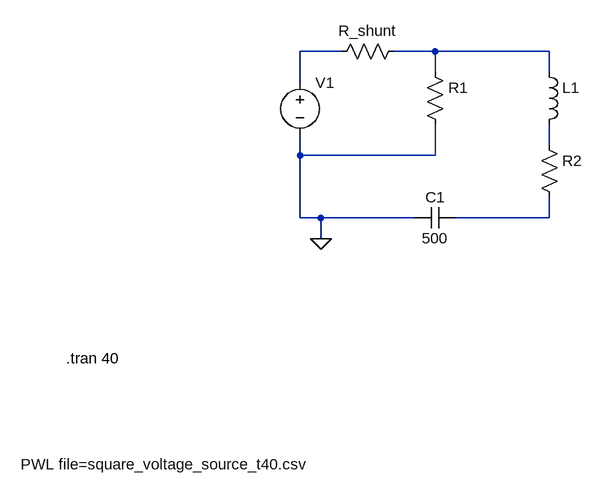
[diagram p0: schematic rlc_proposal.asc]
rlc_proposal.asc, the LTspice schematic file:
Version 4.1
SHEET 1 880 748
WIRE 112 96 48 96
WIRE 256 96 192 96
WIRE 432 96 256 96
WIRE 256 128 256 96
WIRE 432 128 432 96
WIRE 48 144 48 96
WIRE 432 240 432 208
WIRE 48 256 48 224
WIRE 256 256 256 208
WIRE 256 256 48 256
WIRE 48 352 48 256
WIRE 80 352 48 352
WIRE 224 352 80 352
WIRE 432 352 432 320
WIRE 432 352 288 352
WIRE 80 384 80 352
FLAG 80 384 0
SYMBOL voltage 48 128 R0
WINDOW 3 -430 603 Left 2
WINDOW 123 0 0 Left 0
WINDOW 39 0 0 Left 0
SYMATTR InstName V1
SYMATTR Value PWL file=square_voltage_source_t40.csv
SYMBOL res 240 112 R0
SYMATTR InstName R1
SYMATTR Value ""
SYMBOL ind 416 112 R0
SYMATTR InstName L1
SYMATTR Value ""
SYMBOL res 416 224 R0
SYMATTR InstName R2
SYMATTR Value ""
SYMBOL cap 288 336 R90
WINDOW 0 0 32 VBottom 2
WINDOW 3 32 32 VTop 2
SYMATTR InstName C1
SYMATTR Value 500
SYMBOL res 96 112 R270
WINDOW 0 32 56 VTop 2
WINDOW 3 0 56 VBottom 2
SYMATTR InstName R_shunt
SYMATTR Value ""
TEXT -312 568 Left 2 !.tran 40

The netlist it stands for:
* rlc_proposal.asc
V1 N001 0 PWL file=square_voltage_source_t40.csv
R1 N002 0
L1 N002 N003
R2 N003 N004
C1 N004 0 500
R_shunt N001 N002
.tran 40
.backanno
.end